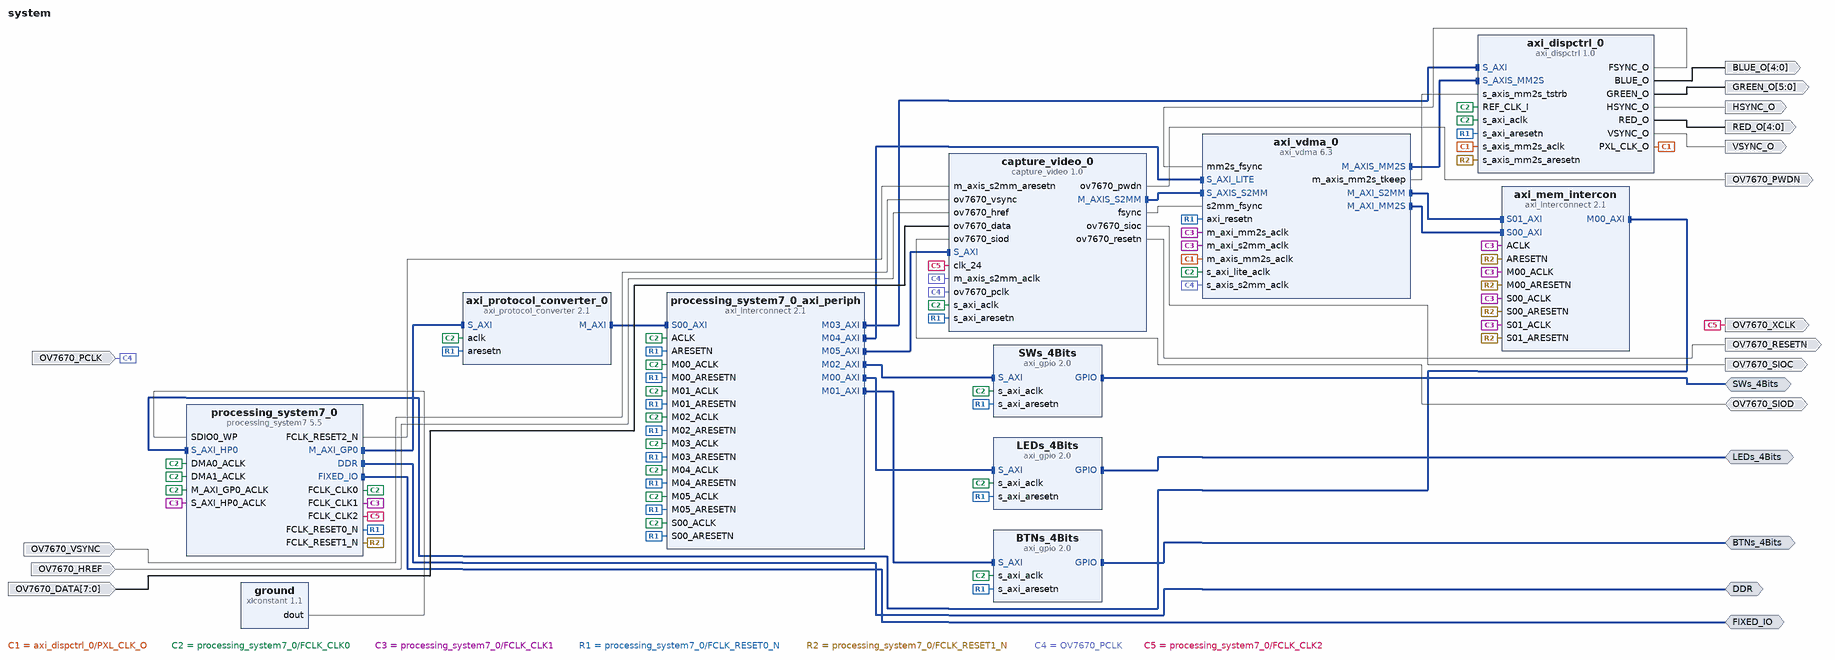
[diagram p0: block diagram of the top level]
# Vivado block design system, xc7z010clg400-1, Vivado 2019.2.1
create_bd_design system

create_bd_intf_port -mode Master -vlnv xilinx.com:interface:gpio_rtl:1.0 BTNs_4Bits
create_bd_intf_port -mode Master -vlnv xilinx.com:interface:ddrx_rtl:1.0 DDR
create_bd_intf_port -mode Master -vlnv xilinx.com:display_processing_system7:fixedio_rtl:1.0 FIXED_IO
create_bd_intf_port -mode Master -vlnv xilinx.com:interface:gpio_rtl:1.0 LEDs_4Bits
create_bd_intf_port -mode Master -vlnv xilinx.com:interface:gpio_rtl:1.0 SWs_4Bits
create_bd_port -dir O -from 4 -to 0 BLUE_O
create_bd_port -dir O -from 5 -to 0 GREEN_O
create_bd_port -dir O HSYNC_O
create_bd_port -dir O -from 4 -to 0 RED_O
create_bd_port -dir O VSYNC_O
create_bd_port -dir I OV7670_VSYNC
create_bd_port -dir I OV7670_HREF
create_bd_port -dir I -type clk OV7670_PCLK
create_bd_port -dir O OV7670_PWDN
create_bd_port -dir I -from 7 -to 0 OV7670_DATA
create_bd_port -dir O OV7670_SIOC
create_bd_port -dir O -type rst OV7670_RESETN
create_bd_port -dir O -type clk OV7670_XCLK
create_bd_port -dir IO OV7670_SIOD

create_bd_cell -type ip -vlnv Digilent:digilent:axi_dispctrl:1.0 axi_dispctrl_0
set_property -dict {CONFIG.C_BLUE_WIDTH 5 CONFIG.C_GREEN_WIDTH 6 CONFIG.C_RED_WIDTH 5} [get_bd_cells axi_dispctrl_0]
create_bd_cell -type ip -vlnv xilinx.com:ip:processing_system7:5.5 processing_system7_0
set_property -dict [list \
  CONFIG.PCW_APU_PERIPHERAL_FREQMHZ 650.000000 \
  CONFIG.PCW_CRYSTAL_PERIPHERAL_FREQMHZ 50.000000 \
  CONFIG.PCW_ENET0_ENET0_IO {MIO 16 .. 27} \
  CONFIG.PCW_ENET0_GRP_MDIO_ENABLE 1 \
  CONFIG.PCW_ENET0_GRP_MDIO_IO {MIO 52 .. 53} \
  CONFIG.PCW_ENET0_PERIPHERAL_ENABLE 1 \
  CONFIG.PCW_ENET_RESET_ENABLE 0 \
  CONFIG.PCW_EN_CLK1_PORT 1 \
  CONFIG.PCW_EN_CLK2_PORT 1 \
  CONFIG.PCW_EN_RST1_PORT 1 \
  CONFIG.PCW_EN_RST2_PORT 1 \
  CONFIG.PCW_FCLK1_PERIPHERAL_CLKSRC {DDR PLL} \
  CONFIG.PCW_FCLK_CLK1_BUF TRUE \
  CONFIG.PCW_FCLK_CLK2_BUF TRUE \
  CONFIG.PCW_FPGA0_PERIPHERAL_FREQMHZ 100.000000 \
  CONFIG.PCW_FPGA1_PERIPHERAL_FREQMHZ 150 \
  CONFIG.PCW_FPGA2_PERIPHERAL_FREQMHZ 24 \
  CONFIG.PCW_FPGA3_PERIPHERAL_FREQMHZ 100.000000 \
  CONFIG.PCW_FPGA_FCLK1_ENABLE 1 \
  CONFIG.PCW_FPGA_FCLK2_ENABLE 1 \
  CONFIG.PCW_GP0_EN_MODIFIABLE_TXN 0 \
  CONFIG.PCW_GP1_EN_MODIFIABLE_TXN 0 \
  CONFIG.PCW_GPIO_MIO_GPIO_ENABLE 1 \
  CONFIG.PCW_GPIO_MIO_GPIO_IO MIO \
  CONFIG.PCW_GPIO_PERIPHERAL_ENABLE 1 \
  CONFIG.PCW_I2C_RESET_ENABLE 0 \
  CONFIG.PCW_IMPORT_BOARD_PRESET ./lib/xml/ZYBO_zynq_def.xml \
  CONFIG.PCW_PERIPHERAL_BOARD_PRESET None \
  CONFIG.PCW_PRESET_BANK1_VOLTAGE {LVCMOS 1.8V} \
  CONFIG.PCW_QSPI_GRP_FBCLK_ENABLE 1 \
  CONFIG.PCW_QSPI_GRP_FBCLK_IO {MIO 8} \
  CONFIG.PCW_QSPI_GRP_SINGLE_SS_ENABLE 1 \
  CONFIG.PCW_QSPI_GRP_SINGLE_SS_IO {MIO 1 .. 6} \
  CONFIG.PCW_QSPI_PERIPHERAL_ENABLE 1 \
  CONFIG.PCW_QSPI_QSPI_IO {MIO 1 .. 6} \
  CONFIG.PCW_SD0_GRP_CD_ENABLE 1 \
  CONFIG.PCW_SD0_GRP_CD_IO {MIO 47} \
  CONFIG.PCW_SD0_GRP_WP_ENABLE 1 \
  CONFIG.PCW_SD0_GRP_WP_IO EMIO \
  CONFIG.PCW_SD0_PERIPHERAL_ENABLE 1 \
  CONFIG.PCW_SD0_SD0_IO {MIO 40 .. 45} \
  CONFIG.PCW_SDIO_PERIPHERAL_FREQMHZ 50 \
  CONFIG.PCW_SINGLE_QSPI_DATA_MODE x4 \
  CONFIG.PCW_TRACE_INTERNAL_WIDTH 32 \
  CONFIG.PCW_UART1_PERIPHERAL_ENABLE 1 \
  CONFIG.PCW_UART1_UART1_IO {MIO 48 .. 49} \
  CONFIG.PCW_UART_PERIPHERAL_FREQMHZ 50 \
  CONFIG.PCW_UIPARAM_DDR_FREQ_MHZ 525.000000 \
  CONFIG.PCW_UIPARAM_DDR_PARTNO {MT41K128M16 JT-125} \
  CONFIG.PCW_USB0_PERIPHERAL_ENABLE 1 \
  CONFIG.PCW_USB0_USB0_IO {MIO 28 .. 39} \
  CONFIG.PCW_USB_RESET_ENABLE 0 \
  CONFIG.PCW_USE_DMA0 1 \
  CONFIG.PCW_USE_DMA1 1 \
  CONFIG.PCW_USE_S_AXI_HP0 1 \
] [get_bd_cells processing_system7_0]
# 485 more settings of processing_system7_0 are not shown: defaults, MIO pin electricals, DDR timing, and values the tool derives
create_bd_cell -type ip -vlnv xilinx.com:ip:axi_gpio:2.0 BTNs_4Bits
set_property -dict {CONFIG.C_ALL_INPUTS 1 CONFIG.C_GPIO_WIDTH 4} [get_bd_cells BTNs_4Bits]
create_bd_cell -type ip -vlnv xilinx.com:ip:axi_gpio:2.0 LEDs_4Bits
set_property -dict {CONFIG.C_ALL_OUTPUTS 1 CONFIG.C_GPIO_WIDTH 4} [get_bd_cells LEDs_4Bits]
create_bd_cell -type ip -vlnv xilinx.com:ip:axi_gpio:2.0 SWs_4Bits
set_property -dict {CONFIG.C_ALL_INPUTS 1 CONFIG.C_GPIO_WIDTH 4} [get_bd_cells SWs_4Bits]
create_bd_cell -type ip -vlnv xilinx.com:ip:axi_interconnect:2.1 axi_mem_intercon
set_property -dict [list \
  CONFIG.ENABLE_ADVANCED_OPTIONS 0 \
  CONFIG.NUM_MI 1 \
  CONFIG.NUM_SI 2 \
  CONFIG.SYNCHRONIZATION_STAGES 2 \
] [get_bd_cells axi_mem_intercon]
create_bd_cell -type ip -vlnv xilinx.com:ip:axi_protocol_converter:2.1 axi_protocol_converter_0
set_property -dict {CONFIG.MI_PROTOCOL AXI4LITE} [get_bd_cells axi_protocol_converter_0]
create_bd_cell -type ip -vlnv xilinx.com:ip:axi_vdma:6.3 axi_vdma_0
set_property -dict [list \
  CONFIG.c_enable_all 1 \
  CONFIG.c_enable_mm2s_delay_counter 0 \
  CONFIG.c_enable_mm2s_frm_counter 0 \
  CONFIG.c_enable_s2mm_delay_counter 0 \
  CONFIG.c_enable_s2mm_frm_counter 0 \
  CONFIG.c_include_s2mm 1 \
  CONFIG.c_m_axi_mm2s_data_width 64 \
  CONFIG.c_m_axi_s2mm_data_width 64 \
  CONFIG.c_mm2s_genlock_mode 1 \
  CONFIG.c_mm2s_linebuffer_depth 2048 \
  CONFIG.c_mm2s_max_burst_length 16 \
  CONFIG.c_num_fstores 1 \
  CONFIG.c_s2mm_genlock_mode 0 \
  CONFIG.c_s2mm_linebuffer_depth 2048 \
  CONFIG.c_s2mm_max_burst_length 16 \
  CONFIG.c_use_mm2s_fsync 1 \
  CONFIG.c_use_s2mm_fsync 1 \
] [get_bd_cells axi_vdma_0]
create_bd_cell -type ip -vlnv xilinx.com:ip:xlconstant:1.1 ground
set_property -dict {CONFIG.CONST_VAL 0} [get_bd_cells ground]
create_bd_cell -type ip -vlnv xilinx.com:ip:axi_interconnect:2.1 processing_system7_0_axi_periph
set_property -dict [list \
  CONFIG.ENABLE_ADVANCED_OPTIONS 0 \
  CONFIG.M00_HAS_REGSLICE 4 \
  CONFIG.M01_HAS_REGSLICE 4 \
  CONFIG.M02_HAS_REGSLICE 4 \
  CONFIG.M03_HAS_REGSLICE 4 \
  CONFIG.M04_HAS_REGSLICE 4 \
  CONFIG.M05_HAS_REGSLICE 4 \
  CONFIG.M06_HAS_REGSLICE 4 \
  CONFIG.M07_HAS_REGSLICE 4 \
  CONFIG.NUM_MI 6 \
  CONFIG.STRATEGY 1 \
  CONFIG.SYNCHRONIZATION_STAGES 2 \
] [get_bd_cells processing_system7_0_axi_periph]
create_bd_cell -type ip -vlnv xilinx.com:user:capture_video:1.0 capture_video_0

# ---- connections ----

connect_bd_intf_net [get_bd_intf_pins axi_mem_intercon/M00_AXI] [get_bd_intf_pins processing_system7_0/S_AXI_HP0]
connect_bd_intf_net [get_bd_intf_pins axi_vdma_0/M_AXI_S2MM] [get_bd_intf_pins axi_mem_intercon/S01_AXI]
connect_bd_intf_net [get_bd_intf_pins axi_dispctrl_0/S_AXIS_MM2S] [get_bd_intf_pins axi_vdma_0/M_AXIS_MM2S]
connect_bd_intf_net [get_bd_intf_pins processing_system7_0_axi_periph/M05_AXI] [get_bd_intf_pins capture_video_0/S_AXI]
connect_bd_intf_net -intf_net processing_system7_0_M_AXI_GP0 [get_bd_intf_pins axi_protocol_converter_0/M_AXI] [get_bd_intf_pins processing_system7_0_axi_periph/S00_AXI]
connect_bd_intf_net [get_bd_intf_pins axi_mem_intercon/S00_AXI] [get_bd_intf_pins axi_vdma_0/M_AXI_MM2S]
connect_bd_intf_net [get_bd_intf_pins axi_vdma_0/S_AXI_LITE] [get_bd_intf_pins processing_system7_0_axi_periph/M04_AXI]
connect_bd_intf_net [get_bd_intf_pins SWs_4Bits/S_AXI] [get_bd_intf_pins processing_system7_0_axi_periph/M02_AXI]
connect_bd_intf_net [get_bd_intf_pins capture_video_0/M_AXIS_S2MM] [get_bd_intf_pins axi_vdma_0/S_AXIS_S2MM]
connect_bd_intf_net [get_bd_intf_pins axi_dispctrl_0/S_AXI] [get_bd_intf_pins processing_system7_0_axi_periph/M03_AXI]
connect_bd_intf_net [get_bd_intf_ports SWs_4Bits] [get_bd_intf_pins SWs_4Bits/GPIO]
connect_bd_intf_net [get_bd_intf_ports BTNs_4Bits] [get_bd_intf_pins BTNs_4Bits/GPIO]
connect_bd_intf_net [get_bd_intf_ports LEDs_4Bits] [get_bd_intf_pins LEDs_4Bits/GPIO]
connect_bd_intf_net [get_bd_intf_ports DDR] [get_bd_intf_pins processing_system7_0/DDR]
connect_bd_intf_net [get_bd_intf_pins BTNs_4Bits/S_AXI] [get_bd_intf_pins processing_system7_0_axi_periph/M01_AXI]
connect_bd_intf_net [get_bd_intf_ports FIXED_IO] [get_bd_intf_pins processing_system7_0/FIXED_IO]
connect_bd_intf_net [get_bd_intf_pins LEDs_4Bits/S_AXI] [get_bd_intf_pins processing_system7_0_axi_periph/M00_AXI]
connect_bd_intf_net [get_bd_intf_pins axi_protocol_converter_0/S_AXI] [get_bd_intf_pins processing_system7_0/M_AXI_GP0]
connect_bd_net [get_bd_pins axi_dispctrl_0/BLUE_O] [get_bd_ports BLUE_O]
connect_bd_net [get_bd_pins axi_dispctrl_0/FSYNC_O] [get_bd_pins axi_vdma_0/mm2s_fsync]
connect_bd_net [get_bd_pins axi_dispctrl_0/GREEN_O] [get_bd_ports GREEN_O]
connect_bd_net [get_bd_pins axi_dispctrl_0/HSYNC_O] [get_bd_ports HSYNC_O]
connect_bd_net [get_bd_pins axi_dispctrl_0/PXL_CLK_O] [get_bd_pins axi_dispctrl_0/s_axis_mm2s_aclk] [get_bd_pins axi_vdma_0/m_axis_mm2s_aclk]
connect_bd_net [get_bd_pins axi_dispctrl_0/RED_O] [get_bd_ports RED_O]
connect_bd_net [get_bd_pins axi_dispctrl_0/VSYNC_O] [get_bd_ports VSYNC_O]
connect_bd_net [get_bd_pins axi_vdma_0/m_axis_mm2s_tkeep] [get_bd_pins axi_dispctrl_0/s_axis_mm2s_tstrb]
connect_bd_net [get_bd_pins processing_system7_0/FCLK_CLK0] \
  [get_bd_pins axi_dispctrl_0/REF_CLK_I] [get_bd_pins axi_dispctrl_0/s_axi_aclk] \
  [get_bd_pins processing_system7_0/M_AXI_GP0_ACLK] [get_bd_pins processing_system7_0/DMA0_ACLK] \
  [get_bd_pins processing_system7_0/DMA1_ACLK] [get_bd_pins BTNs_4Bits/s_axi_aclk] [get_bd_pins LEDs_4Bits/s_axi_aclk] \
  [get_bd_pins SWs_4Bits/s_axi_aclk] [get_bd_pins axi_protocol_converter_0/aclk] [get_bd_pins axi_vdma_0/s_axi_lite_aclk] \
  [get_bd_pins processing_system7_0_axi_periph/ACLK] [get_bd_pins processing_system7_0_axi_periph/S00_ACLK] \
  [get_bd_pins processing_system7_0_axi_periph/M00_ACLK] [get_bd_pins processing_system7_0_axi_periph/M01_ACLK] \
  [get_bd_pins processing_system7_0_axi_periph/M02_ACLK] [get_bd_pins processing_system7_0_axi_periph/M03_ACLK] \
  [get_bd_pins processing_system7_0_axi_periph/M04_ACLK] [get_bd_pins processing_system7_0_axi_periph/M05_ACLK] \
  [get_bd_pins capture_video_0/s_axi_aclk]
connect_bd_net [get_bd_pins processing_system7_0/FCLK_CLK1] \
  [get_bd_pins processing_system7_0/S_AXI_HP0_ACLK] [get_bd_pins axi_mem_intercon/ACLK] \
  [get_bd_pins axi_mem_intercon/S00_ACLK] [get_bd_pins axi_mem_intercon/S01_ACLK] [get_bd_pins axi_mem_intercon/M00_ACLK] \
  [get_bd_pins axi_vdma_0/m_axi_mm2s_aclk] [get_bd_pins axi_vdma_0/m_axi_s2mm_aclk]
connect_bd_net -net rst_processing_system7_0_97M_interconnect_aresetn [get_bd_pins processing_system7_0/FCLK_RESET0_N] \
  [get_bd_pins axi_dispctrl_0/s_axi_aresetn] [get_bd_pins BTNs_4Bits/s_axi_aresetn] [get_bd_pins LEDs_4Bits/s_axi_aresetn] \
  [get_bd_pins SWs_4Bits/s_axi_aresetn] [get_bd_pins axi_protocol_converter_0/aresetn] [get_bd_pins axi_vdma_0/axi_resetn] \
  [get_bd_pins processing_system7_0_axi_periph/ARESETN] [get_bd_pins processing_system7_0_axi_periph/S00_ARESETN] \
  [get_bd_pins processing_system7_0_axi_periph/M00_ARESETN] [get_bd_pins processing_system7_0_axi_periph/M01_ARESETN] \
  [get_bd_pins processing_system7_0_axi_periph/M02_ARESETN] [get_bd_pins processing_system7_0_axi_periph/M03_ARESETN] \
  [get_bd_pins processing_system7_0_axi_periph/M04_ARESETN] [get_bd_pins processing_system7_0_axi_periph/M05_ARESETN] \
  [get_bd_pins capture_video_0/s_axi_aresetn]
connect_bd_net -net rst_processing_system7_0_97M_peripheral_aresetn [get_bd_pins processing_system7_0/FCLK_RESET1_N] \
  [get_bd_pins axi_dispctrl_0/s_axis_mm2s_aresetn] [get_bd_pins axi_mem_intercon/ARESETN] \
  [get_bd_pins axi_mem_intercon/S00_ARESETN] [get_bd_pins axi_mem_intercon/S01_ARESETN] \
  [get_bd_pins axi_mem_intercon/M00_ARESETN]
connect_bd_net [get_bd_pins ground/dout] [get_bd_pins processing_system7_0/SDIO0_WP]
connect_bd_net -net capture_video_0_FSYNC_O [get_bd_pins capture_video_0/fsync] [get_bd_pins axi_vdma_0/s2mm_fsync]
connect_bd_net [get_bd_ports OV7670_VSYNC] [get_bd_pins capture_video_0/ov7670_vsync]
connect_bd_net [get_bd_ports OV7670_HREF] [get_bd_pins capture_video_0/ov7670_href]
connect_bd_net [get_bd_ports OV7670_PCLK] \
  [get_bd_pins axi_vdma_0/s_axis_s2mm_aclk] [get_bd_pins capture_video_0/ov7670_pclk] \
  [get_bd_pins capture_video_0/m_axis_s2mm_aclk]
connect_bd_net [get_bd_pins capture_video_0/ov7670_pwdn] [get_bd_ports OV7670_PWDN]
connect_bd_net [get_bd_ports OV7670_DATA] [get_bd_pins capture_video_0/ov7670_data]
connect_bd_net [get_bd_pins capture_video_0/ov7670_sioc] [get_bd_ports OV7670_SIOC]
connect_bd_net [get_bd_pins capture_video_0/ov7670_resetn] [get_bd_ports OV7670_RESETN]
connect_bd_net [get_bd_pins processing_system7_0/FCLK_CLK2] [get_bd_ports OV7670_XCLK] [get_bd_pins capture_video_0/clk_24]
connect_bd_net [get_bd_ports OV7670_SIOD] [get_bd_pins capture_video_0/ov7670_siod]
connect_bd_net [get_bd_pins processing_system7_0/FCLK_RESET2_N] [get_bd_pins capture_video_0/m_axis_s2mm_aresetn]

# ---- address map ----
assign_bd_address -offset 0x00000000 -range 512M -target_address_space [get_bd_addr_spaces axi_vdma_0/Data_MM2S] [get_bd_addr_segs processing_system7_0/S_AXI_HP0/HP0_DDR_LOWOCM]
assign_bd_address -offset 0x00000000 -range 512M -target_address_space [get_bd_addr_spaces axi_vdma_0/Data_S2MM] [get_bd_addr_segs processing_system7_0/S_AXI_HP0/HP0_DDR_LOWOCM]
assign_bd_address -offset 0x41200000 -range 64K -target_address_space [get_bd_addr_spaces processing_system7_0/Data] [get_bd_addr_segs BTNs_4Bits/S_AXI/Reg]
assign_bd_address -offset 0x41210000 -range 64K -target_address_space [get_bd_addr_spaces processing_system7_0/Data] [get_bd_addr_segs LEDs_4Bits/S_AXI/Reg]
assign_bd_address -offset 0x41220000 -range 64K -target_address_space [get_bd_addr_spaces processing_system7_0/Data] [get_bd_addr_segs SWs_4Bits/S_AXI/Reg]
assign_bd_address -offset 0x43000000 -range 64K -target_address_space [get_bd_addr_spaces processing_system7_0/Data] [get_bd_addr_segs axi_vdma_0/S_AXI_LITE/Reg]
assign_bd_address -offset 0x43C00000 -range 64K -target_address_space [get_bd_addr_spaces processing_system7_0/Data] [get_bd_addr_segs axi_dispctrl_0/S_AXI/S_AXI_reg]
assign_bd_address -offset 0x43C10000 -range 64K -target_address_space [get_bd_addr_spaces processing_system7_0/Data] [get_bd_addr_segs capture_video_0/S_AXI/S_AXI_reg]

validate_bd_design
save_bd_design
